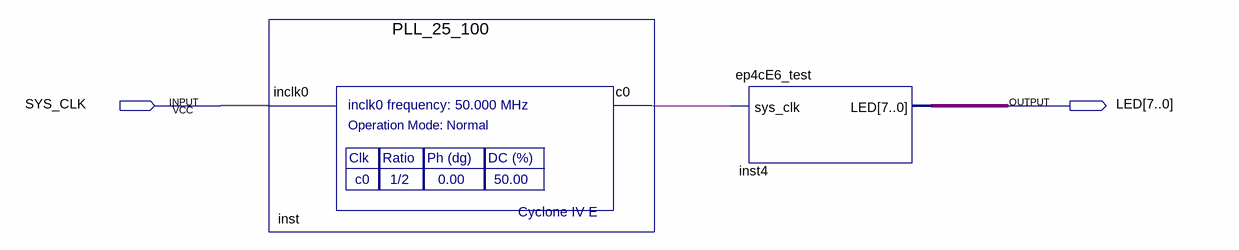
[diagram p0: schematic sheet]
// Quartus schematic EP4CE6_PLL_TEST.bdf as structural Verilog: 2 symbols, 2 pins
module EP4CE6_PLL_TEST (
  input  SYS_CLK,
  output [7:0] LED
);

  wire inst_c0;

  PLL_25_100 inst (.inclk0(SYS_CLK), .c0(inst_c0));
  ep4cE6_test inst4 (.sys_clk(inst_c0), .LED(LED));
endmodule
